# EAGLE schematic n_by_n_array (EAGLE 9.3.0)
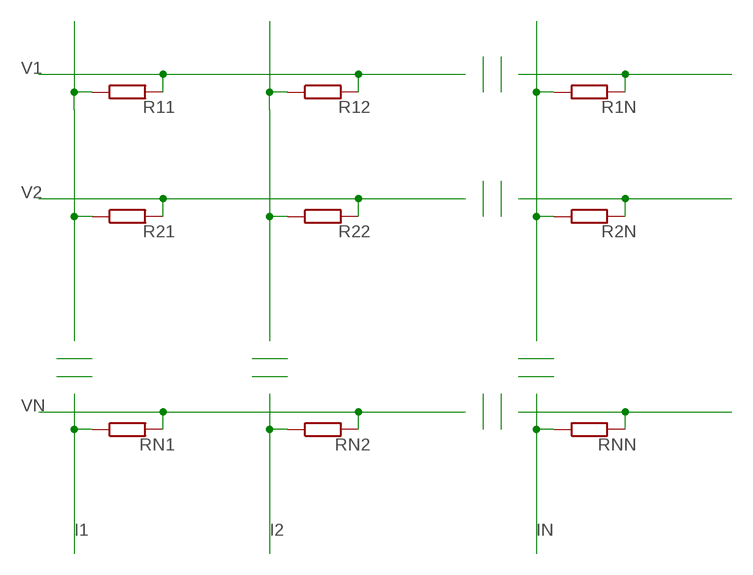
[diagram p0: schematic, sheet 1]

## Parts
R1N  R-EU_0204/2V  [0204V]
R2N  R-EU_0204/2V  [0204V]
R11  R-EU_0204/2V  [0204V]
R12  R-EU_0204/2V  [0204V]
R21  R-EU_0204/2V  [0204V]
R22  R-EU_0204/2V  [0204V]
RN1  R-EU_0204/2V  [0204V]
RN2  R-EU_0204/2V  [0204V]
RNN  R-EU_0204/2V  [0204V]

## Nets
I1: R21.1 RN1.1
I2: RN2.1
IN: RNN.1
N$1: R12.1 R22.1
N$2: R11.1
N$5: R1N.1 R2N.1
N$9: R2N.2
N$10: R1N.2
N$21: RNN.2
V1: R11.2 R12.2
V2: R21.2 R22.2
VN: RN1.2 RN2.2

## Library data of the parts
R1N R2N R11 R12 R21 R22 RN1 RN2 RNN = resistor:R-EU_: RESISTOR, European symbol